# EAGLE design Schematic_start_module_sumo_IR_V1_0 (EAGLE 6.3)
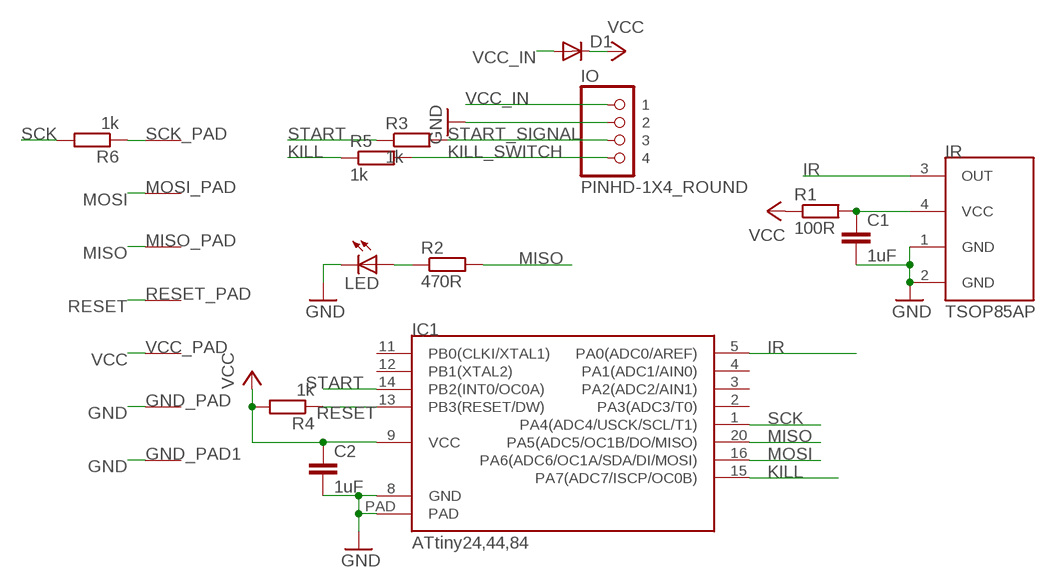
[diagram p0: schematic, sheet 1]

## Parts
C1  1uF  C-EUC0603  [C0603]
C2  1uF  C-EUC0603  [C0603]
D1  DIODE-SOD523  [SOD523]
GND_PAD  PAD50X50  [PAD_50X50]
GND_PAD1  PAD75X75  [PAD_75X75]
IC1  ATTINY24,44,84_QFNVQFN  [VQFN20]
IO  PINHD-1X4_ROUND  [1X04_ROUND]
IR  TSOP85AP  [TSOP85AP]
LED  LED0603  [0603_SMALL]
MISO_PAD  mosi  PAD50X50  [PAD_50X50]
MOSI_PAD  PAD50X50  [PAD_50X50]
R1  100R  R-EU_R0402  [R0402]
R2  470R  R-EU_R0402  [R0402]
R3  1k  R-EU_R0402  [R0402]
R4  1k  R-EU_R0402  [R0402]
R5  1k  R-EU_R0402  [R0402]
R6  1k  R-EU_R0402  [R0402]
RESET_PAD  PAD50X50  [PAD_50X50]
SCK_PAD  PAD75X75  [PAD_75X75]
VCC_PAD  PAD50X50  [PAD_50X50]

## Nets
GND: C1.2 C2.2 GND_PAD1.P$1(PAD) GND_PAD.P$1(PAD) IC1.8(GND) IC1.PAD IO.2 IR.1(GND) IR.2(GND) LED.2(C)
IR: IC1.5(PA0(ADC0/AREF)) IR.3(OUT)
KILL: IC1.15(PA7(ADC7/ISCP/OC0B)) R5.1
KILL_SWITCH: IO.4 R5.2
MISO: IC1.20(PA5(ADC5/OC1B/DO/MISO)) MISO_PAD.P$1(PAD) R2.2
MOSI: IC1.16(PA6(ADC6/OC1A/SDA/DI/MOSI)) MOSI_PAD.P$1(PAD)
N$1: LED.1(A) R2.1
N$2: R6.1 SCK_PAD.P$1(PAD)
N$6: C1.1 IR.4(VCC) R1.2
RESET: IC1.13(PB3(RESET/DW)) R4.1 RESET_PAD.P$1(PAD)
SCK: IC1.1(PA4(ADC4/USCK/SCL/T1)) R6.2
START: IC1.14(PB2(INT0/OC0A)) R3.1
START_SIGNAL: IO.3 R3.2
VCC: C2.1 D1.C IC1.9(VCC) R1.1 R4.2 VCC_PAD.P$1(PAD)
VCC_IN: D1.A IO.1
Unconnected: IC1.2(PA3(ADC3/T0)) IC1.3(PA2(ADC2/AIN1)) IC1.4(PA1(ADC1/AIN0)) IC1.11(PB0(CLKI/XTAL1)) IC1.12(PB1(XTAL2))

## Library data of the parts
C1 C2 = rcl:C-EU: CAPACITOR, European symbol
D1 = diode:DIODE-: DIODE
GND_PAD GND_PAD1 MISO_PAD MOSI_PAD RESET_PAD SCK_PAD VCC_PAD = CRF:PAD
IC1 = CRF:ATTINY24,44,84_QFN: ATtiny24,44,84 Small 8-bit microcontroller from Atmel. Available in QFN(MLF)20 and SOIC14. VQFN is available for the A-variant. http://atmel.com/dyn/resources/prod_documents/doc8006.pdf
IO = CRF:PINHD-1X4
IR = CRF:TSOP85AP: Low profile IR receiver Avialable at mouser for 1.5€. http://www.vishay.com/doc?85197
LED = CRF:LED: LED
R1-R6 = rcl:R-EU_: RESISTOR, European symbol

## Board
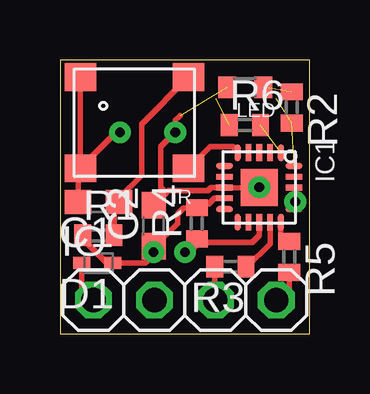
[diagram p1: board, top side]
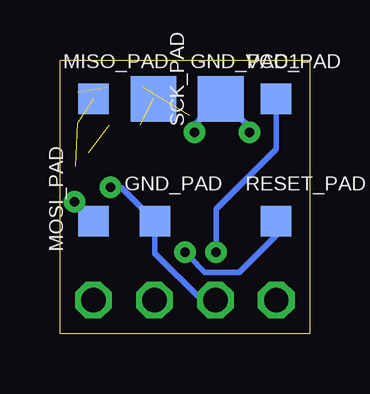
[diagram p2: board, bottom side, seen from below]

Size 10.4 x 11.42 mm. Coordinates in mm from the lower left corner, seen from the top.
Outline: 0,0 10.4,0 10.4,11.42 0,11.42 0,0
Copper layers (1*16): Top 0.0356mm / dielectric 1.5011mm / Bottom 0.0356mm
Design rules "LaenPCBOrder *": minimum track width 6mil, minimum drill 13mil, track to track 0.2mm, track to pad 0.2mm, pad to pad 0.2mm, via to via 0.2mm, smd to smd 0mil, copper to edge 15mil, drill to drill 6mil, minimum pad ring 7mil, minimum via ring 7mil, stop-mask expansion 0.1036mm, vias tented up to drill 0.4mm, thermal gap 10mil

### Footprints (pad centres in the part's own frame; a part is rotated, then mirrored left to right if it is on the bottom)
C0603 = smd 1.1 x 1: 1 -0.85,0; 2 0.85,0
SOD523 = smd 0.7 x 0.5: A 0.7,0; C -0.6,0
PAD_50X50 = smd 1.27 x 1.27: P$1 0,0
PAD_75X75 = smd 1.905 x 1.905: P$1 0,0
VQFN20 = smd 0.7 x 0.24: 1 -1.45,0.9; 2 -1.45,0.45; 3 -1.45,0; 4 -1.45,-0.45; 5 -1.45,-0.9; 11 1.45,-0.9; 12 1.45,-0.45; 13 1.45,0; 14 1.45,0.45; 15 1.45,0.9 | smd 0.24 x 0.7: 6 -0.9,-1.45; 7 -0.45,-1.45; 8 0,-1.45; 9 0.45,-1.45; 10 0.9,-1.45; 16 0.9,1.45; 17 0.45,1.45; 18 0,1.45; 19 -0.45,1.45; 20 -0.9,1.45 | smd 1.55 x 1.55: PAD 0,0
1X04_ROUND = drill 1.016 octagon: 1 -3.81,0; 2 -1.27,0; 3 1.27,0; 4 3.81,0
TSOP85AP = smd 1.3 x 1.15: 1 2.25,-1.9; 2 2.25,1.9; 3 -2.25,1.9; 4 -2.25,-1.9
0603_SMALL = smd 0.75 x 0.9: 1 -0.75,0; 2 0.75,0
R0402 = smd 0.7 x 0.9: 1 -0.65,0; 2 0.65,0

### Placement (x,y rotation side)
C1  1.6,5.5 180 top
C2  3.9,4.5 90 top
D1  1.6,2.94 180 top
GND_PAD  6.45,4.7 0 bottom
GND_PAD1  3.7,9.8 0 bottom
IC1  8.3,6.1 270 top
IO  5.2,1.4 0 top
IR  3.1,8.8 180 top
LED  7.71,10.28 180 top
MISO_PAD  9,9.8 0 bottom
MOSI_PAD  9,4.7 90 bottom
R1  1.6,4.1 0 top
R2  9.66,9.44 270 top
R3  7.1,2.8 180 top
R4  5.7,4.6 90 top
R5  9.55,3.2 270 top
R6  7.7,8.7 0 top
RESET_PAD  1.4,4.7 0 bottom
SCK_PAD  6.5,9.8 180 bottom
VCC_PAD  1.4,9.8 0 bottom

### Tracks (layer width: path | path; a pad name or v marks a point on that pad's centre or on a via)
GND  (via drill 0.4 pad 0.9)  (1 unrouted)
  Top 0.2: IC1.8 IC1.PAD
  Top 0.23: IC1.8 6.3,6.1 6.17,5.97 4.52,5.97 4.42,5.88 | 4.42,5.88 C2.2 | 5,9.1 4.8,8.9 v4.8,8.4 4.2,7.8 4.2,6.1 4.42,5.88 | C1.2 0.75,6.8 IR.2 | IR.1 IR.2 | IR.2 2.35,8.4 v2.5,8.4
  Bottom 0.23: v4.8,8.4 4.8,8.7 GND_PAD1.P$1 2.5,8.6 v2.5,8.4 | IC1.PAD 7.85,6.1 GND_PAD.P$1 6.45,3.35 4.5,1.4 IO.2
  other vias: 8.3,6.1
IR
  Top 0.23: IR.3 6.25,7.8 7.2,7.8 7.4,7.6 IC1.5
KILL
  Top 0.23: IC1.15 9.2,4.15 R5.1
KILL_SWITCH
  Top 0.23: IO.4 9.55,1.94 R5.2
MISO  (2 unrouted)
MOSI  (via drill 0.4 pad 0.9)
  Top 0.23: IC1.16 9.8,5.25 v9.8,5.5
  Bottom 0.23: MOSI_PAD.P$1 v9.8,5.5
N$1  (1 unrouted)
N$2  (1 unrouted)
N$6
  Top 0.23: R1.2 2.25,5.3 C1.1 2.45,5.65 3.4,6.6 3.4,8.75 IR.4
RESET  (via drill 0.4 pad 0.9)
  Top 0.23: IC1.13 8.3,4.1 8,3.8 5.85,3.8 | 5.85,3.8 R4.1 | 5.85,3.8 5.8,3.8 5.4,3.4 v5.2,3.4
  Bottom 0.23: v5.2,3.4 5,3.4 5,3.2 4.37,2.56 2.94,2.56 1.4,4.1 RESET_PAD.P$1
SCK  (1 unrouted)
START
  Top 0.23: IC1.14 8.75,3.75 7.8,2.8 R3.1
START_SIGNAL
  Top 0.23: IO.3 6.45,1.42 R3.2
VCC  (via drill 0.4 pad 0.9)
  Top 0.23: IC1.9 6.45,5.65 6.2,5.4 5.85,5.4 R4.2 5.15,5.25 4.9,5 4.9,4.6 3.95,3.65 C2.1 v3.9,3.4 3.9,3.3 3.54,2.94 D1.C 1.96,2.94 0.95,3.95 R1.1
  Bottom 0.23: VCC_PAD.P$1 1.4,7.7 3.9,5.2 v3.9,3.4
VCC_IN
  Top 0.23: IO.1 0.9,1.89 D1.A

### Text on the board
tTest: V0.16
bTest: GND | HOME | VCC | GND | Start | Kill
bDocu: HOME | GND | VCC | GND | START | KILL